# EAGLE design press-control (EAGLE 8.4.3)
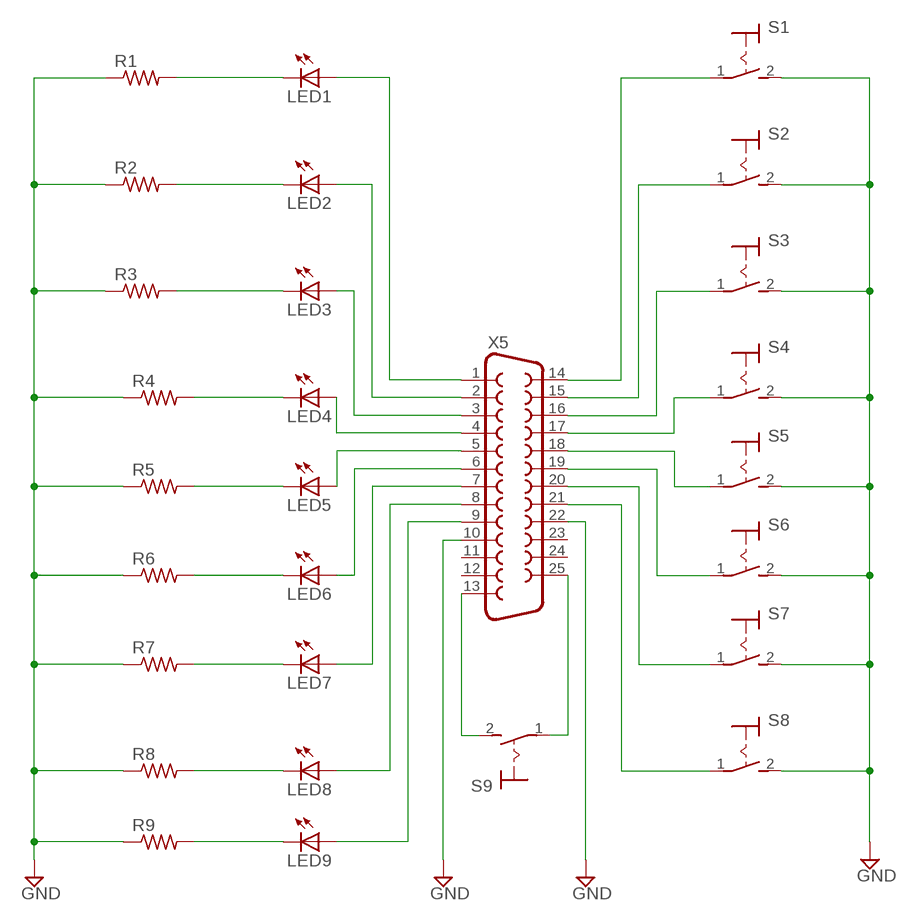
[diagram p0: schematic, sheet 1]

## Parts
LED1  LED5MM  [LED5MM]
LED2  LED5MM  [LED5MM]
LED3  LED5MM  [LED5MM]
LED4  LED5MM  [LED5MM]
LED5  LED5MM  [LED5MM]
LED6  LED5MM  [LED5MM]
LED7  LED5MM  [LED5MM]
LED8  LED5MM  [LED5MM]
LED9  LED5MM  [LED5MM]
R1  R-US_0207/10  [0207/10]
R2  R-US_0207/10  [0207/10]
R3  R-US_0207/10  [0207/10]
R4  R-US_0207/10  [0207/10]
R5  R-US_0207/10  [0207/10]
R6  R-US_0207/10  [0207/10]
R7  R-US_0207/10  [0207/10]
R8  R-US_0207/10  [0207/10]
R9  R-US_0207/10  [0207/10]
S1  MS243  [MS243]
S2  MS243  [MS243]
S3  MS243  [MS243]
S4  MS243  [MS243]
S5  MS243  [MS243]
S6  MS243  [MS243]
S7  MS243  [MS243]
S8  MS243  [MS243]
S9  MS243  [MS243]
X5  DB25_FEMALEV  [F25V]

## Nets
GND: R1.1 R2.1 R3.1 R4.1 R5.1 R6.1 R7.1 R8.1 R9.1 S1.2(S) S2.2(S) S3.2(S) S4.2(S) S5.2(S) S6.2(S) S7.2(S) S8.2(S) X5.10 X5.22
N$1: LED1.K(C) R1.2
N$2: LED2.K(C) R2.2
N$3: LED3.K(C) R3.2
N$4: LED4.K(C) R4.2
N$5: LED5.K(C) R5.2
N$6: LED6.K(C) R6.2
N$7: LED7.K(C) R7.2
N$8: LED8.K(C) R8.2
N$9: LED4.A X5.4
N$10: LED5.A X5.5
N$11: LED3.A X5.3
N$12: LED2.A X5.2
N$13: LED1.A X5.1
N$14: LED6.A X5.6
N$15: LED7.A X5.7
N$16: LED8.A X5.8
N$17: S5.1(P) X5.18
N$18: S4.1(P) X5.17
N$19: S3.1(P) X5.16
N$20: S2.1(P) X5.15
N$21: S1.1(P) X5.14
N$22: S6.1(P) X5.19
N$23: S7.1(P) X5.20
N$24: S8.1(P) X5.21
N$25: S9.2(S) X5.13
N$26: S9.1(P) X5.25
N$27: LED9.A X5.9
N$28: LED9.K(C) R9.2
Unconnected: X5.11 X5.12 X5.23 X5.24

## Library data of the parts
LED1-LED9 = adafruit:LED: LED OSRAM: - CHIPLED LG R971, LG N971, LY N971, LG Q971, LY Q971, LO R971, LY R971 LH N974, LH R974 LS Q976, LO Q976, LY Q976 LO Q996 - Hyper CHIPLED LW Q18S LB Q993, LB Q99A, LB R99A - SideLED LS A670, LO A670, LY A670, LG A670, LP A670 LB A673, LV A673, LT A673, LW A673 LH A674 LY A675 LS A676, LA A676, LO A676, LY A676, LW A676 LS A679, LY A679, LG A679 - Hyper Micro SIDELED® LS Y876, LA Y876, LO Y876, LY Y876 LT Y87S - SmartLED LW L88C, LW L88S LB L89C, LB L89S, LG L890 LS L89K, LO L89K, LY L89K LS L896, LA L896, LO L896, LY L896 - TOPLED LS T670, LO T670, LY T670, LG T670, LP T670 LSG T670, LSP T670, LSY T670, LOP T670, LYG T670 LG T671, LOG T671, LSG T671 LB T673, LV T673, LT T673, LW T673 LH T674 LS T676, LA T676, LO T676, LY T676, LB T676, LH T676, LSB T676, LW T676 LB T67C, LV T67C, LT T67C, LS T67K, LO T67K, LY T67K, LW E67C LS E67B, LA E67B, LO E67B, LY E67B, LB E67C, LV E67C, LT E67C LW T67C LS T679, LY T679, LG T679 LS T770, LO T770, LY T770, LG T770, LP T770 LB T773, LV T773, LT T773, LW T773 LH T774 LS E675, LA E675, LY E675, LS T675 LS T776, LA T776, LO T776, LY T776, LB T776 LHGB T686 LT T68C, LB T68C - Hyper Mini TOPLED® LB M676 - Mini TOPLED Santana® LG M470 LS M47K, LO M47K, LY M47K Source: http://www.osram.convergy.de/
R1-R9 = resistor:R-US_: RESISTOR, American symbol
S1-S9 = switch:MS243: TOGGLE SWITCH
X5 = SparkFun-Retired:DB25_FEMALE: 25 Pin male connector. PCB edge mount for regular PCB thicknesses. This connector will connect directly to the back of a PC parallel port or through a normal DB25 extension cable (M/F). SKU: PRT-08287

## Board
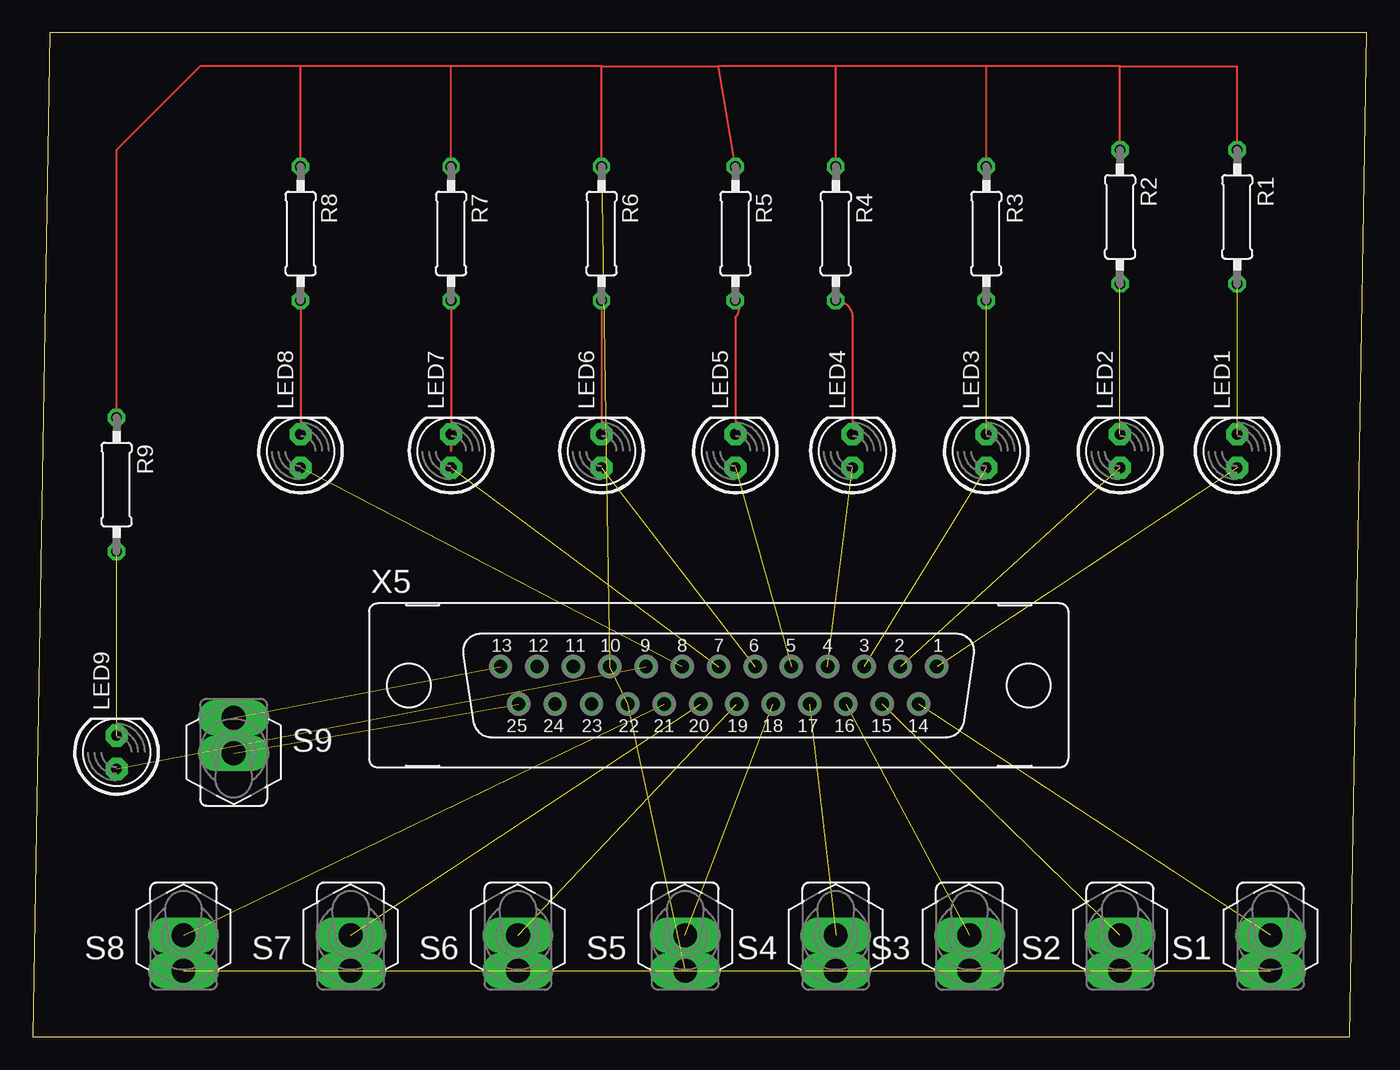
[diagram p1: board, top side]

Size 101.27 x 76.19 mm. Coordinates in mm from the lower left corner, seen from the top.
Outline: 0,0 100,0 101.27,76.19 1.27,76.19 0,0
Copper layers (1*16): Top 0.035mm / dielectric 1.5mm / Bottom 0.035mm
Design rules "default": minimum track width 6mil, minimum drill 0.35mm, track to track 6mil, track to pad 6mil, pad to pad 6mil, via to via 6mil, smd to smd 6mil, copper to edge 40mil, drill to drill 6mil, minimum pad ring 10mil, minimum via ring 8mil, stop-mask expansion 4mil, vias tented up to drill 0mil, thermal gap 10mil

### Footprints (pad centres in the part's own frame; a part is rotated, then mirrored left to right if it is on the bottom)
LED5MM = drill 0.813 pad 1.676 octagon: A -1.27,0; K 1.27,0
0207/10 = drill 0.813 octagon: 1 -5.08,0; 2 5.08,0
MS243 = drill 1.803 pad 2 long: 1 0,-1.346; 2 0,1.346
F25V = drill 1.016 octagon: 1 16.561,1.422; 2 13.792,1.422; 3 11.049,1.422; 4 8.28,1.422; 5 5.512,1.422; 6 2.769,1.422; 7 0,1.422; 8 -2.769,1.422; 9 -5.512,1.422; 10 -8.28,1.422; 11 -11.049,1.422; 12 -13.792,1.422; 13 -16.561,1.422; 14 15.189,-1.422; 15 12.421,-1.422; 16 9.652,-1.422; 17 6.909,-1.422; 18 4.14,-1.422; 19 1.372,-1.422; 20 -1.372,-1.422; 21 -4.14,-1.422; 22 -6.909,-1.422; 23 -9.652,-1.422; 24 -12.421,-1.422; 25 -15.189,-1.422 | hole 3.302: 23.52,0; -23.52,0

### Placement (x,y rotation side)
LED1  91.44,44.45 90 top
LED2  82.55,44.45 90 top
LED3  72.39,44.45 90 top
LED4  62.23,44.45 90 top
LED5  53.34,44.45 90 top
LED6  43.18,44.45 90 top
LED7  31.75,44.45 90 top
LED8  20.32,44.45 90 top
LED9  6.35,21.59 90 top
R1  91.44,62.23 270 top
R2  82.55,62.23 270 top
R3  72.39,60.96 270 top
R4  60.96,60.96 270 top
R5  53.34,60.96 270 top
R6  43.18,60.96 270 top
R7  31.75,60.96 270 top
R8  20.32,60.96 270 top
R9  6.35,41.91 270 top
S1  93.98,6.35 180 top
S2  82.55,6.35 180 top
S3  71.12,6.35 180 top
S4  60.96,6.35 180 top
S5  49.53,6.35 180 top
S6  36.83,6.35 180 top
S7  24.13,6.35 180 top
S8  11.43,6.35 180 top
S9  15.24,22.86 0 top
X5  52.07,26.67 0 top

### Tracks (layer width: path | path; a pad name or v marks a point on that pad's centre or on a via)
GND  (10 unrouted)
  Top 0.152: R9.1 6.35,67.31 12.7,73.66 20.32,73.66 | 31.75,73.66 20.32,73.66 | 43.18,73.66 52.07,73.66 | 43.18,73.66 31.75,73.66 | 60.96,73.66 52.07,73.66 | 72.39,73.66 60.96,73.66 | 82.55,73.66 91.44,73.66 R1.1 | 82.55,73.66 72.39,73.66 | R8.1 20.32,73.66 | R7.1 31.75,73.66 | R5.1 52.07,73.66 | R6.1 43.18,73.66 | R4.1 60.96,73.66 | R3.1 72.39,73.66 | R2.1 82.55,73.66
N$1  (1 unrouted)
N$2  (1 unrouted)
N$3  (1 unrouted)
N$4
  Top 0.152: R4.2 arc-90 62.23,54.61 LED4.K
N$5
  Top 0.152: R5.2 arc-90 53.34,54.61 LED5.K
N$6
  Top 0.152: R6.2 LED6.K
N$7
  Top 0.152: R7.2 LED7.K | LED7.K 31.75,44.45 LED7.K
N$8
  Top 0.152: R8.2 LED8.K
N$9  (1 unrouted)
N$10  (1 unrouted)
N$11  (1 unrouted)
N$12  (1 unrouted)
N$13  (1 unrouted)
N$14  (1 unrouted)
N$15  (1 unrouted)
N$16  (1 unrouted)
N$17  (1 unrouted)
N$18  (1 unrouted)
N$19  (1 unrouted)
N$20  (1 unrouted)
N$21  (1 unrouted)
N$22  (1 unrouted)
N$23  (1 unrouted)
N$24  (1 unrouted)
N$25  (1 unrouted)
N$26  (1 unrouted)
N$27  (1 unrouted)
N$28  (1 unrouted)